# EAGLE design icewerx Carrier (EAGLE 9.6.2)
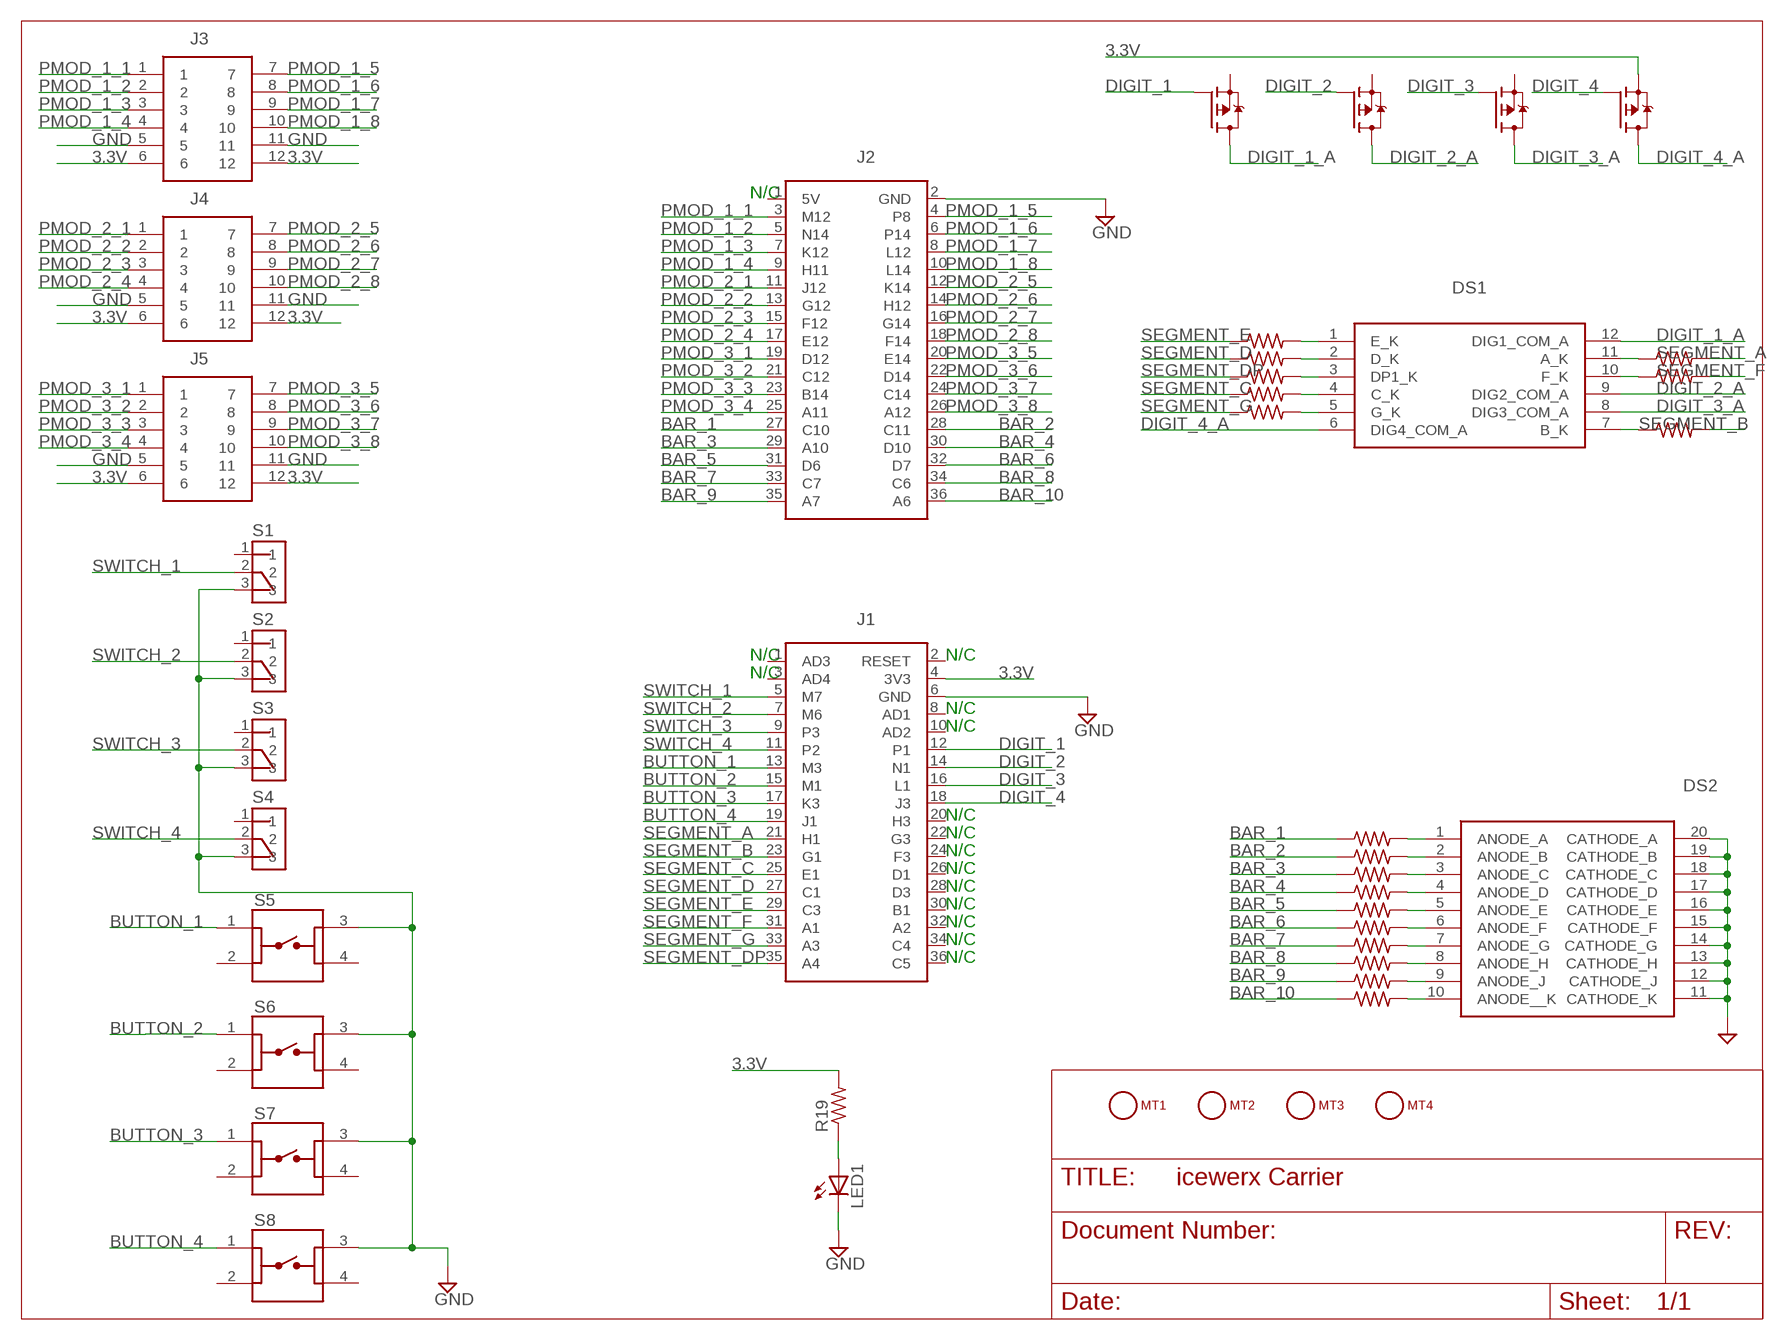
[diagram p0: schematic, sheet 1]

## Parts
DS1  LDQ-M282RI  [LDQM282RI]
DS2  LTA-1000G  [DIPS762W50P254L2527H825Q20N]
J1  ICEWERX-PL2  [TE_4-1734506-1]
J2  ICEWERX-PL3  [TE_4-1734506-1]
J3  PMOD-SOCKET-FOR-HOST-BOARD  [PMOD-SOCKET-FOR-HOST-BOARD]
J4  PMOD-SOCKET-FOR-HOST-BOARD  [PMOD-SOCKET-FOR-HOST-BOARD]
J5  PMOD-SOCKET-FOR-HOST-BOARD  [PMOD-SOCKET-FOR-HOST-BOARD]
LED1  LED5MM  [LED5MM]
MT1  MOUNTING_HOLE-125_250_ROUND  [MT_125_250]
MT2  MOUNTING_HOLE-125_250_ROUND  [MT_125_250]
MT3  MOUNTING_HOLE-125_250_ROUND  [MT_125_250]
MT4  MOUNTING_HOLE-125_250_ROUND  [MT_125_250]
Q1  NX2301P  [SOT95P230X110-3N]
Q2  NX2301P  [SOT95P230X110-3N]
Q3  NX2301P  [SOT95P230X110-3N]
Q4  NX2301P  [SOT95P230X110-3N]
R1  R-US_0204/5  [0204/5]
R2  R-US_0204/5  [0204/5]
R3  R-US_0204/5  [0204/5]
R4  R-US_0204/5  [0204/5]
R5  R-US_0204/5  [0204/5]
R6  R-US_0204/5  [0204/5]
R7  R-US_0204/5  [0204/5]
R8  R-US_0204/5  [0204/5]
R9  R-US_0204/5  [0204/5]
R10  R-US_0204/5  [0204/5]
R11  R-US_0204/5  [0204/5]
R12  R-US_0204/5  [0204/5]
R13  R-US_0204/5  [0204/5]
R14  R-US_0204/5  [0204/5]
R15  R-US_0204/5  [0204/5]
R16  R-US_0204/5  [0204/5]
R17  R-US_0204/5  [0204/5]
R18  R-US_0204/5  [0204/5]
R19  R-US_0204/5  [0204/5]
S1  OS102011MS2QN1  [SW_OS102011MS2QN1]
S2  OS102011MS2QN1  [SW_OS102011MS2QN1]
S3  OS102011MS2QN1  [SW_OS102011MS2QN1]
S4  OS102011MS2QN1  [SW_OS102011MS2QN1]
S5  1825910-7  [SW_1825910-7]
S6  1825910-7  [SW_1825910-7]
S7  1825910-7  [SW_1825910-7]
S8  1825910-7  [SW_1825910-7]

## Nets
3.3V: J1.4(3V3) J3.6 J3.12 J4.6 J4.12 J5.6 J5.12 Q4.2(S) R19.2
BAR_1: J2.27(C10) R1.1
BAR_2: J2.28(C11) R2.1
BAR_3: J2.29(A10) R3.1
BAR_4: J2.30(D10) R5.1
BAR_5: J2.31(D6) R4.1
BAR_6: J2.32(D7) R6.1
BAR_7: J2.33(C7) R7.1
BAR_8: J2.34(C6) R8.1
BAR_9: J2.35(A7) R10.1
BAR_10: J2.36(A6) R9.1
BUTTON_1: J1.13(M3) S5.1
BUTTON_2: J1.15(M1) S6.1
BUTTON_3: J1.17(K3) S7.1
BUTTON_4: J1.19(J1) S8.1
DIGIT_1: J1.12(P1) Q1.1(G)
DIGIT_1_A: DS1.12(DIG1_COM_A) Q1.3(D)
DIGIT_2: J1.14(N1) Q2.1(G)
DIGIT_2_A: DS1.9(DIG2_COM_A) Q2.3(D)
DIGIT_3: J1.16(L1) Q3.1(G)
DIGIT_3_A: DS1.8(DIG3_COM_A) Q3.3(D)
DIGIT_4: J1.18(J3) Q4.1(G)
DIGIT_4_A: DS1.6(DIG4_COM_A) Q4.3(D)
GND: DS2.11(CATHODE_K) DS2.12(CATHODE_J) DS2.13(CATHODE_H) DS2.14(CATHODE_G) DS2.15(CATHODE_F) DS2.16(CATHODE_E) DS2.17(CATHODE_D) DS2.18(CATHODE_C) DS2.19(CATHODE_B) DS2.20(CATHODE_A) J1.6(GND) J2.2(GND) J3.5 J3.11 J4.5 J4.11 J5.5 J5.11 LED1.K(C) S1.3 S2.3 S3.3 S4.3 S5.3 S6.3 S7.3 S8.3
N$1: DS1.1(E_K) R11.2
N$2: DS1.2(D_K) R12.2
N$3: DS1.3(DP1_K) R13.2
N$4: DS1.4(C_K) R14.2
N$5: DS1.5(G_K) R15.2
N$6: DS1.11(A_K) R16.1
N$8: DS1.7(B_K) R18.1
N$9: DS2.1(ANODE_A) R1.2
N$10: DS2.2(ANODE_B) R2.2
N$11: DS2.3(ANODE_C) R3.2
N$12: DS2.5(ANODE_E) R4.2
N$13: DS2.4(ANODE_D) R5.2
N$14: DS2.6(ANODE_F) R6.2
N$15: DS2.8(ANODE_H) R8.2
N$16: DS2.10(ANODE__K) R9.2
N$17: DS2.9(ANODE_J) R10.2
N$18: DS2.7(ANODE_G) R7.2
N$19: LED1.A R19.1
N$140: DS1.10(F_K) R17.1
PMOD_1_1: J2.3(M12) J3.1
PMOD_1_2: J2.5(N14) J3.2
PMOD_1_3: J2.7(K12) J3.3
PMOD_1_4: J2.9(H11) J3.4
PMOD_1_5: J2.4(P8) J3.7
PMOD_1_6: J2.6(P14) J3.8
PMOD_1_7: J2.8(L12) J3.9
PMOD_1_8: J2.10(L14) J3.10
PMOD_2_1: J2.11(J12) J4.1
PMOD_2_2: J2.13(G12) J4.2
PMOD_2_3: J2.15(F12) J4.3
PMOD_2_4: J2.17(E12) J4.4
PMOD_2_5: J2.12(K14) J4.7
PMOD_2_6: J2.14(H12) J4.8
PMOD_2_7: J2.16(G14) J4.9
PMOD_2_8: J2.18(F14) J4.10
PMOD_3_1: J2.19(D12) J5.1
PMOD_3_2: J2.21(C12) J5.2
PMOD_3_3: J2.23(B14) J5.3
PMOD_3_4: J2.25(A11) J5.4
PMOD_3_5: J2.20(E14) J5.7
PMOD_3_6: J2.22(D14) J5.8
PMOD_3_7: J2.24(C14) J5.9
PMOD_3_8: J2.26(A12) J5.10
SEGMENT_A: J1.21(H1) R16.2
SEGMENT_B: J1.23(G1) R18.2
SEGMENT_C: J1.25(E1) R14.1
SEGMENT_D: J1.27(C1) R12.1
SEGMENT_DP: J1.35(A4) R13.1
SEGMENT_E: J1.29(C3) R11.1
SEGMENT_F: J1.31(A1) R17.2
SEGMENT_G: J1.33(A3) R15.1
SWITCH_1: J1.5(M7) S1.2
SWITCH_2: J1.7(M6) S2.2
SWITCH_3: J1.9(P3) S3.2
SWITCH_4: J1.11(P2) S4.2
Unconnected: J1.1(AD3) J1.2(RESET) J1.3(AD4) J1.8(AD1) J1.10(AD2) J1.20(H3) J1.22(G3) J1.24(F3) J1.26(D1) J1.28(D3) J1.30(B1) J1.32(A2) J1.34(C4) J1.36(C5) J2.1(5V) MT1.1 MT2.1 MT3.1 MT4.1 Q1.2(S) Q2.2(S) Q3.2(S) S1.1 S2.1 S3.1 S4.1 S5.2 S5.4 S6.2 S6.4 S7.2 S7.4 S8.2 S8.4

## Notes on the sheet
- N/C
- N/C | N/C
- N/C
- N/C
- N/C
- N/C
- N/C
- N/C
- N/C
- N/C
- N/C
- N/C
- N/C
- N/C

## Library data of the parts
DS1 = eagle-library-engr-240-f22:LDQ-M282RI: LED Displays & Accessories LED Display Source: Datasheet <https://componentsearchengine.com/Datasheets/1/LDQ-M282RI.pdf>; DESCRIPTION: LED Displays & Accessories LED Display; HEIGHT: 6.05mm; MANUFACTURER_NAME: Lumex; MANUFACTURER_PART_NUMBER: LDQ-M282RI; MOUSER_PART_NUMBER: 696-LDQ-M282RI; MOUSER_PRICE-STOCK: https://www.mouser.com/Search/Refine.aspx?Keyword=696-LDQ-M282RI
DS2 = eagle-library-engr-240-f22:LTA-1000G: LED Uni-Color Green 565nm 20-Pin PDIP Source: Datasheet <https://optoelectronics.liteon.com/upload/download/DS-30-92-0809/A1000G.pdf>; DESCRIPTION: LED Uni-Color Green 565nm 20-Pin PDIP; HEIGHT: 8.25mm; MANUFACTURER_NAME: Lite-On; MANUFACTURER_PART_NUMBER: LTA-1000G; MOUSER_PART_NUMBER: 859-LTA-1000G; MOUSER_PRICE-STOCK: https://www.mouser.co.uk/ProductDetail/Lite-On/LTA-1000G?qs=%2FTKcI5XXRKq0QINzVmwJHg%3D%3D
J1 = eagle-library-engr-240-f22:ICEWERX-PL2
J2 = eagle-library-engr-240-f22:ICEWERX-PL3
J3-J5 = eagle-library-engr-240-f22:PMOD-SOCKET-FOR-HOST-BOARD
LED1 = eagle-library-engr-240-f22:LED: LED OSRAM: - CHIPLED LG R971, LG N971, LY N971, LG Q971, LY Q971, LO R971, LY R971 LH N974, LH R974 LS Q976, LO Q976, LY Q976 LO Q996 - Hyper CHIPLED LW Q18S LB Q993, LB Q99A, LB R99A - SideLED LS A670, LO A670, LY A670, LG A670, LP A670 LB A673, LV A673, LT A673, LW A673 LH A674 LY A675 LS A676, LA A676, LO A676, LY A676, LW A676 LS A679, LY A679, LG A679 - Hyper Micro SIDELED® LS Y876, LA Y876, LO Y876, LY Y876 LT Y87S - SmartLED LW L88C, LW L88S LB L89C, LB L89S, LG L890 LS L89K, LO L89K, LY L89K LS L896, LA L896, LO L896, LY L896 - TOPLED LS T670, LO T670, LY T670, LG T670, LP T670 LSG T670, LSP T670, LSY T670, LOP T670, LYG T670 LG T671, LOG T671, LSG T671 LB T673, LV T673, LT T673, LW T673 LH T674 LS T676, LA T676, LO T676, LY T676, LB T676, LH T676, LSB T676, LW T676 LB T67C, LV T67C, LT T67C, LS T67K, LO T67K, LY T67K, LW E67C LS E67B, LA E67B, LO E67B, LY E67B, LB E67C, LV E67C, LT E67C LW T67C LS T679, LY T679, LG T679 LS T770, LO T770, LY T770, LG T770, LP T770 LB T773, LV T773, LT T773, LW T773 LH T774 LS E675, LA E675, LY E675, LS T675 LS T776, LA T776, LO T776, LY T776, LB T776 LHGB T686 LT T68C, LB T68C - Hyper Mini TOPLED® LB M676 - Mini TOPLED Santana® LG M470 LS M47K, LO M47K, LY M47K Source: http://www.osram.convergy.de/
MT1-MT4 = eagle-library-engr-240-f22:MOUNTING_HOLE
Q1-Q4 = eagle-library-engr-240-f22:NX2301P; MANUFACTURER: Nexperia; MAXIMUM_PACKAGE_HEIGHT: 1.10 mm; PARTREV: 1; SNAPEDA_PN: NX2301P; STANDARD: IPC 7351B
R1-R19 = eagle-library-engr-240-f22:R-US_: RESISTOR, American symbol
S1-S4 = eagle-library-engr-240-f22:OS102011MS2QN1: Switch Slide ON ON SPDT Top Slide 0.1A 12VDC 10000Cycles PC Pins Thru-Hole Bulk; MANUFACTURER: C&K; STANDARD: MANUFACTURER RECOMMENDATIONS
S5-S8 = eagle-library-engr-240-f22:1825910-7: Switch Tactile OFF (ON) SPST Round Button PC Pins 0.05A 24VDC 100000Cycles 2.55N Thru-Hole Loose; MANUFACTURER: TE Connectivity; PARTREV: C10; STANDARD: Manufacturer Recommendation

## Board
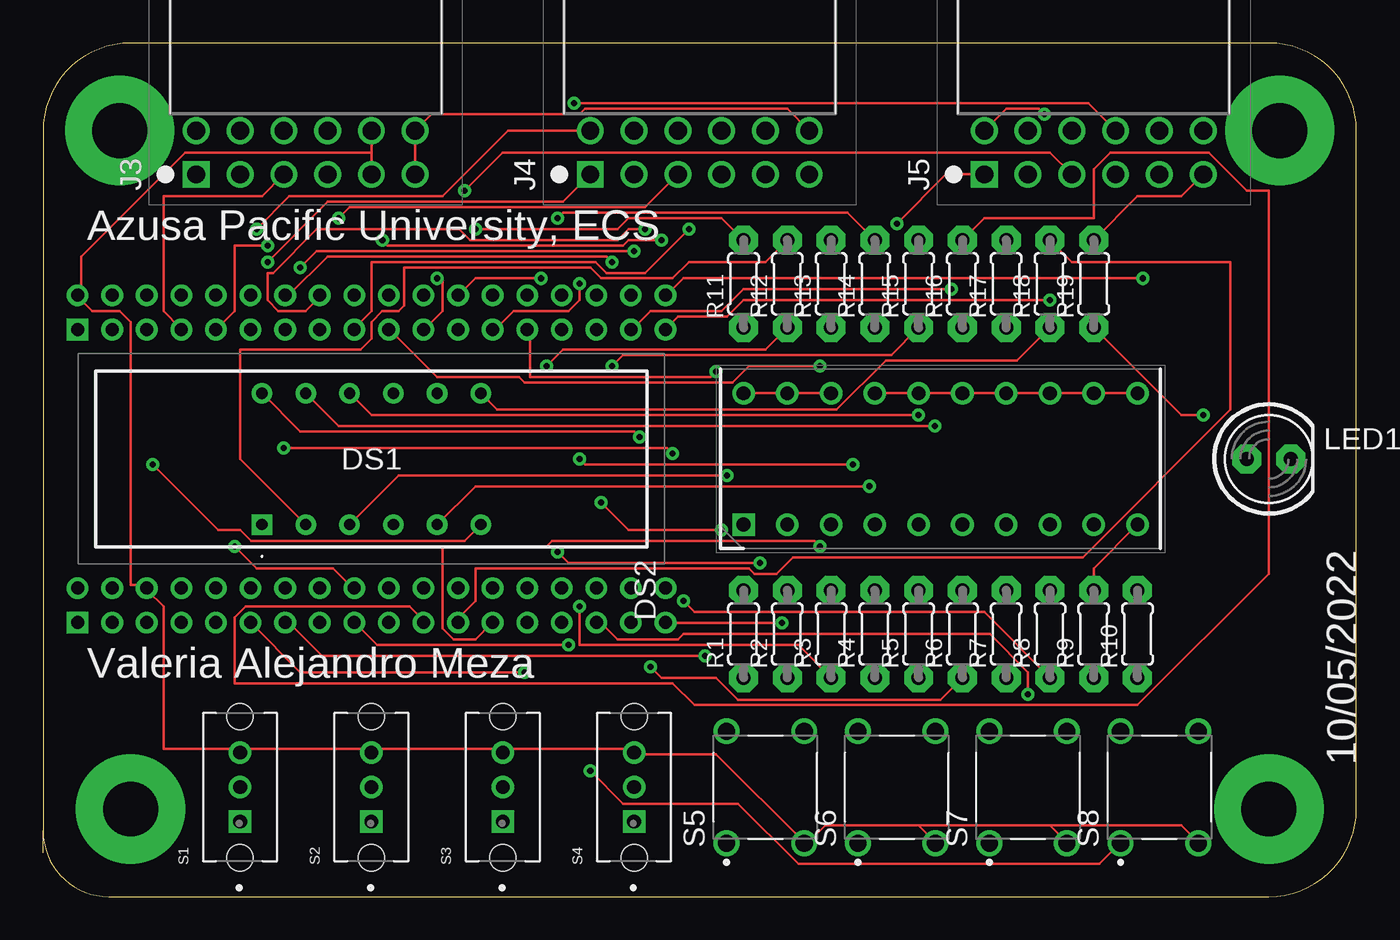
[diagram p1: board, top side]
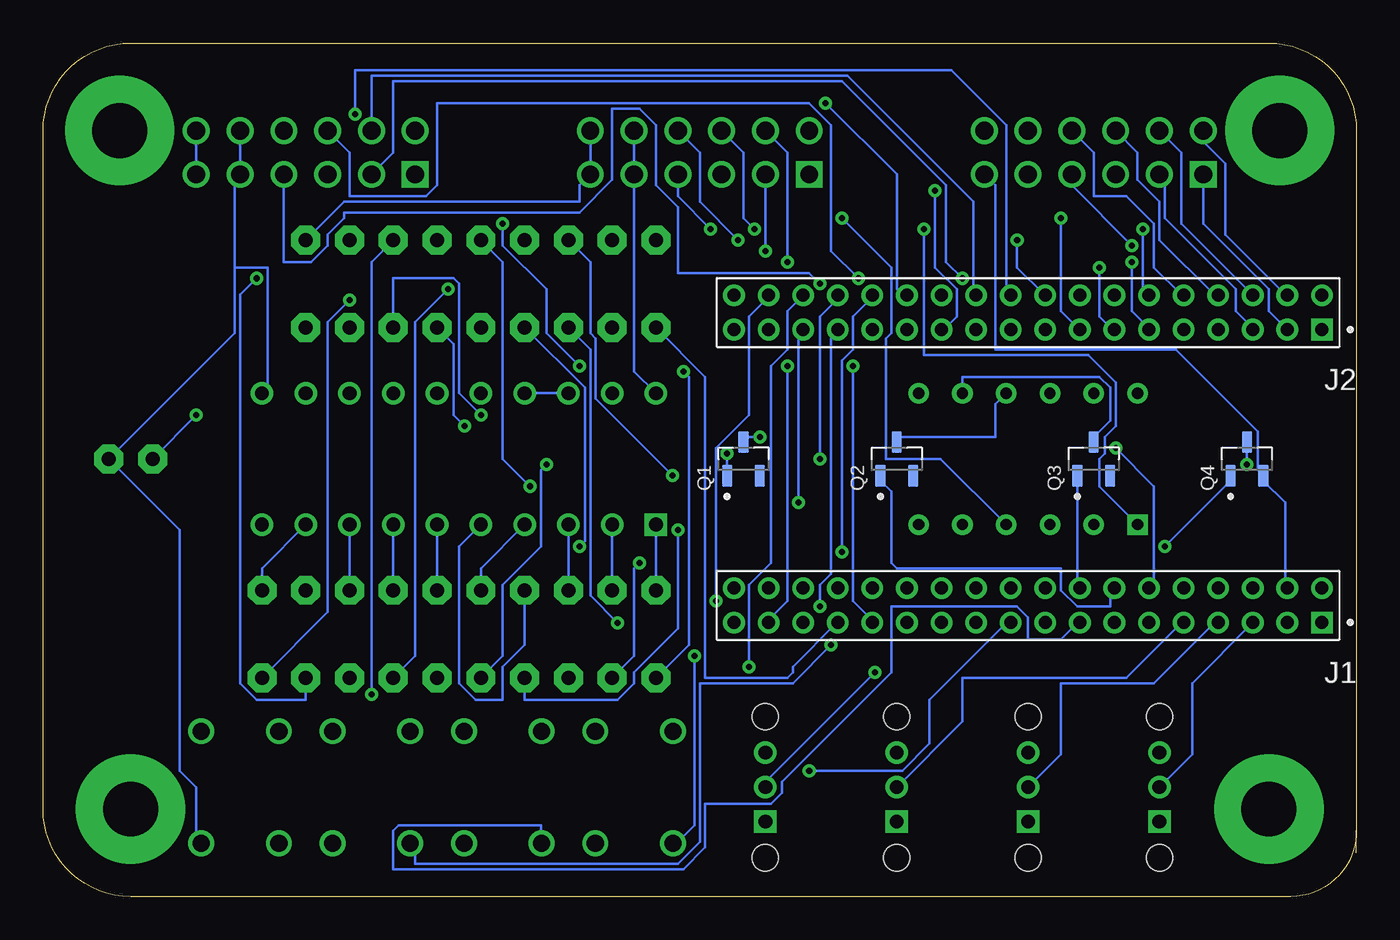
[diagram p2: board, bottom side, seen from below]

Size 76.2 x 49.53 mm. Coordinates in mm from the lower left corner, seen from the top.
Outline: 0,2.54 0,3.81
Outline: 0,3.81 arc90 3.81,0 71.12,0 arc90 76.2,5.08 76.2,44.45 arc90 71.12,49.53 5.08,49.53 arc90 0,44.45 0,3.81
Copper layers (1*16): Top 0.035mm / dielectric 1.5mm / Bottom 0.035mm
Design rules "default *": minimum track width 6mil, minimum drill 0.35mm, track to track 6mil, track to pad 6mil, pad to pad 6mil, via to via 6mil, smd to smd 6mil, copper to edge 40mil, drill to drill 6mil, minimum pad ring 10mil, minimum via ring 8mil, stop-mask expansion 2.5mil, vias tented up to drill 15mil, thermal gap 10mil

### Footprints (pad centres in the part's own frame; a part is rotated, then mirrored left to right if it is on the bottom)
LDQM282RI = drill 0.65 pad 1.192 square: 1 0,0 | drill 0.65 pad 1.192: 2 2.54,0; 3 5.08,0; 4 7.62,0; 5 10.16,0; 6 12.7,0; 7 12.7,7.62; 8 10.16,7.62; 9 7.62,7.62; 10 5.08,7.62; 11 2.54,7.62; 12 0,7.62
DIPS762W50P254L2527H825Q20N = drill 0.8 pad 1.2 square: 1 0,0 | drill 0.8 pad 1.2: 2 0,-2.54; 3 0,-5.08; 4 0,-7.62; 5 0,-10.16; 6 0,-12.7; 7 0,-15.24; 8 0,-17.78; 9 0,-20.32; 10 0,-22.86; 11 7.62,-22.86; 12 7.62,-20.32; 13 7.62,-17.78; 14 7.62,-15.24; 15 7.62,-12.7; 16 7.62,-10.16; 17 7.62,-7.62; 18 7.62,-5.08; 19 7.62,-2.54; 20 7.62,0
TE_4-1734506-1 = drill 0.75 pad 1.1 square: 1 0,0 | drill 0.75 pad 1.1: 2 0,-2; 3 2.007,0; 4 2.007,-2; 5 4.013,0; 6 4.013,-2; 7 6.02,0; 8 6.02,-2; 9 8.026,0; 10 8.026,-2; 11 10.033,0; 12 10.033,-2; 13 12.04,0; 14 12.04,-2; 15 14.046,0; 16 14.046,-2; 17 16.053,0; 18 16.053,-2; 19 18.059,0; 20 18.059,-2; 21 20.066,0; 22 20.066,-2; 23 22.073,0; 24 22.073,-2; 25 24.079,0; 26 24.079,-2; 27 26.086,0; 28 26.086,-2; 29 28.092,0; 30 28.092,-2; 31 30.099,0; 32 30.099,-2; 33 32.106,0; 34 32.106,-2; 35 34.112,0; 36 34.112,-2
PMOD-SOCKET-FOR-HOST-BOARD = drill 1.04 pad 1.55 square: 1 0,0 | drill 1.04 pad 1.55: 2 2.54,0; 3 5.08,0; 4 7.62,0; 5 10.16,0; 6 12.7,0; 7 0,2.54; 8 2.54,2.54; 9 5.08,2.54; 10 7.62,2.54; 11 10.16,2.54; 12 12.7,2.54
LED5MM = drill 0.813 pad 1.676 octagon: A -1.27,0; K 1.27,0
MT_125_250 = drill 3.175 pad 6.35: 1 0,0
SOT95P230X110-3N = smd 1.26 x 0.59: 1 -0.98,0.95; 2 -0.98,-0.95; 3 0.98,0
0204/5 = drill 0.813 pad 1.676 octagon: 1 -2.54,0; 2 2.54,0
SW_OS102011MS2QN1 = drill 0.8 square: 1 -2,0 | drill 0.8: 2 0,0; 3 2,0 | hole 1.5: -4.1,0; 4.1,0
SW_1825910-7 = drill 0.99: 1 -3.25,2.25; 2 3.25,2.25; 3 -3.25,-2.25; 4 3.25,-2.25

### Placement (x,y rotation side)
DS1  12.7,21.59 0 top
DS2  40.64,21.59 90 top
J1  2,15.9 180 bottom
J2  2,32.9 180 bottom
J3  8.89,41.91 0 top
J4  31.75,41.91 0 top
J5  54.61,41.91 0 top
LED1  71.12,25.4 0 top
MT1  4.45,44.45 0 top
MT2  71.75,44.45 0 top
MT3  5.08,5.08 0 top
MT4  71.12,5.08 0 top
Q1  35.56,25.4 90 bottom
Q2  26.67,25.4 90 bottom
Q3  15.24,25.4 90 bottom
Q4  6.35,25.4 90 bottom
R1  40.64,15.24 90 top
R2  43.18,15.24 90 top
R3  45.72,15.24 90 top
R4  48.26,15.24 90 top
R5  50.8,15.24 90 top
R6  53.34,15.24 90 top
R7  55.88,15.24 90 top
R8  58.42,15.24 90 top
R9  60.96,15.24 90 top
R10  63.5,15.24 90 top
R11  40.64,35.56 90 top
R12  43.18,35.56 90 top
R13  45.72,35.56 90 top
R14  48.26,35.56 90 top
R15  50.8,35.56 90 top
R16  53.34,35.56 90 top
R17  55.88,35.56 90 top
R18  58.42,35.56 90 top
R19  60.96,35.56 90 top
S1  11.43,6.35 90 top
S2  19.05,6.35 90 top
S3  26.67,6.35 90 top
S4  34.29,6.35 90 top
S5  41.91,6.35 90 top
S6  49.53,6.35 90 top
S7  57.15,6.35 90 top
S8  64.77,6.35 90 top

### Tracks (layer width: path | path; a pad name or v marks a point on that pad's centre or on a via)
3.3V
  Top 0.152: R19.2 63.5,40.64 66.04,40.64 J5.6 | J3.6 J3.12 22.54,45.4 31.11,45.4 31.43,45.72 43.18,45.72 J4.12
  Bottom 0.152: J5.12 J5.6 | J1.4 4.13,18.1 4.13,22.86 5.4,24.13 Q4.2 5.4,24.45 5.71,24.77 5.71,26.99 10.48,31.75 20.95,31.75 20.95,41.27 J3.6 | J4.12 J4.6 45.09,41.27 45.09,40.32 58.74,40.32 R19.2
BAR_1  (via drill 0.35)
  Top 0.152: v39.05,30.48 38.73,30.16 28.26,30.16 28.26,32.7 J2.27
  Bottom 0.152: v39.05,30.48 38.73,30.16 38.73,14.61 R1.1
BAR_2  (via drill 0.35)
  Top 0.152: v29.84,20 30.48,19.37 v41.59,19.37
  Bottom 0.152: v29.84,20 29.84,31.11 29.21,31.75 29.21,33.66 28.26,34.61 J2.28 | v41.59,19.37 41.91,19.05 41.91,13.97 R2.1
BAR_3  (via drill 0.35)
  Top 0.152: v31.11,16.83 31.11,14.61 43.81,14.61 R3.1
  Bottom 0.152: v31.11,16.83 31.11,18.1 30.48,18.73 30.48,32.38 30.16,32.7 J2.29
BAR_4  (via drill 0.35)
  Top 0.152: v31.11,25.4 31.43,25.08 v46.99,25.08
  Bottom 0.152: v31.11,25.4 31.11,33.66 30.16,34.61 J2.30 | v46.99,25.08 47.31,24.77 47.31,20.32 49.53,18.1 49.53,13.97 R5.1
BAR_5  (via drill 0.35)
  Top 0.152: v32.38,22.86 33.97,21.27 v39.37,21.27
  Bottom 0.152: v32.38,22.86 32.38,32.7 J2.31 | v39.37,21.27 39.37,15.56 41.91,13.02 41.91,12.38 42.86,11.43 48.26,11.43 R4.1
BAR_6  (via drill 0.35)
  Top 0.152: v35.24,13.34 35.88,12.7 39.05,12.7 40.32,11.43 52.07,11.43 R6.1
  Bottom 0.152: v35.24,13.34 35.24,18.1 33.97,19.37 33.97,30.8 33.02,31.75 33.02,33.97 32.38,34.61 J2.32
BAR_7  (via drill 0.35)
  Top 0.152: v52.7,35.24 40.64,35.24 39.37,33.97 35.24,33.97 34.29,33.02 J2.33
  Bottom 0.152: v52.7,35.24 54.61,33.34 54.61,13.97 R7.1
BAR_8  (via drill 0.35)
  Top 0.152: v37.15,17.14 37.78,16.51 54.61,16.51 R8.1
  Bottom 0.152: v37.15,17.14 37.15,26.04 35.24,27.94 35.24,33.66 34.29,34.61 J2.34
BAR_9  (via drill 0.35)
  Top 0.152: v58.42,34.61 40.64,34.61 39.69,33.66 36.83,33.66 36.2,33.02 J2.35
  Bottom 0.152: v58.42,34.61 59.69,33.34 59.69,16.51 R10.1
BAR_10  (via drill 0.35)
  Top 0.152: v63.82,35.88 37.15,35.88 36.2,34.92 J2.36
  Bottom 0.152: v63.82,35.88 64.77,34.92 64.77,12.38 63.82,11.43 60.96,11.43 R9.1
BUTTON_1  (via drill 0.35)
  Top 0.152: v38.42,13.97 16.19,13.97 14.29,15.88 J1.13
  Bottom 0.152: v38.42,13.97 38.42,4.13 39.37,3.17 S5.1
BUTTON_2
  Bottom 0.152: J1.15 16.19,15.88 17.14,14.92 19.05,14.92 19.05,16.19 19.68,16.83 26.99,16.83 26.99,13.02 33.34,6.67 33.34,6.03 33.97,5.4 37.78,5.4 37.78,2.86 39.05,1.59 55.88,1.59 55.88,3.81 55.56,4.13 47.31,4.13 47.31,3.17 S6.1
BUTTON_3  (via drill 0.35)
  Top 0.152: v30.48,14.61 19.37,14.61 18.1,15.88 J1.17
  Bottom 0.152: v30.48,14.61 32.7,12.38 38.1,12.38 38.1,3.17 39.37,1.91 54.61,1.91 54.61,2.86 S7.1
BUTTON_4  (via drill 0.35)
  Top 0.152: v31.75,7.3 33.66,5.4 40.32,5.4 43.81,1.91 61.28,1.91 62.23,2.86 S8.1
  Bottom 0.152: v31.75,7.3 26.35,7.3 24.77,8.89 24.77,11.43 20.32,15.88 J1.19
DIGIT_1  (via drill 0.35)
  Top 0.152: v36.51,25.72 36.2,26.04 v13.97,26.04
  Bottom 0.152: v36.51,25.72 36.51,24.45 Q1.1 | v13.97,26.04 11.75,23.81 11.75,18.1 J1.12
DIGIT_1_A  (via drill 0.35)
  Top 0.152: v34.61,26.67 34.29,26.99 14.92,26.99 DS1.12
  Bottom 0.152: v34.61,26.67 35.56,26.67 Q1.3
DIGIT_2
  Bottom 0.152: Q2.1 27.62,24.13 26.99,23.5 26.99,19.37 26.67,19.05 17.14,19.05 17.14,17.78 16.19,16.83 14.29,16.83 14.29,17.78 J1.14
DIGIT_2_A
  Bottom 0.152: DS1.9 20.95,28.57 20.95,26.67 26.67,26.67 Q2.3
DIGIT_3
  Bottom 0.152: Q3.1 16.19,24.13 16.19,18.1 J1.16
DIGIT_3_A
  Bottom 0.152: DS1.8 22.86,30.16 14.92,30.16 14.29,29.53 14.29,27.62 15.24,26.67 Q3.3
DIGIT_4  (via drill 0.35)
  Top 0.152: v11.11,20.32 12.38,19.05 16.83,19.05 17.78,18.1 J1.18
  Bottom 0.152: v11.11,20.32 7.3,24.13 Q4.1
DIGIT_4_A  (via drill 0.35)
  Top 0.152: v6.35,25.08 10.16,21.27 11.43,21.27 12.06,20.64 24.45,20.64 DS1.6
  Bottom 0.152: v6.35,25.08 Q4.3
GND
  Top 0.152: DS2.17 DS2.16 DS2.15 DS2.14 DS2.13 DS2.12 DS2.11 | DS2.20 DS2.19 DS2.18 | 50.8,4.13 45.4,4.13 44.45,3.17 S5.3 44.13,3.17 39.05,8.26 34.29,8.26 S4.3 34.29,8.57 26.67,8.57 | 50.8,4.13 51.75,3.17 S6.3 | 58.42,4.13 59.37,3.17 S7.3 | 50.8,4.13 58.42,4.13 | 58.42,4.13 66.04,4.13 66.99,3.17 S8.3 | J3.11 19.05,43.18 | 19.05,43.18 J3.5 | 11.43,8.57 6.99,8.57 6.99,16.83 6.03,17.78 J1.6 5.71,18.1 5.08,18.1 5.08,33.34 4.45,33.97 2.86,33.97 2.22,34.61 J2.2 2.22,34.92 2.22,37.15 8.26,43.18 19.05,43.18 | 11.43,8.57 19.05,8.57 | 11.43,8.57 S1.3 | 19.05,8.57 26.67,8.57 | 19.05,8.57 S2.3 | 26.67,8.57 S3.3
  Bottom 0.152: J5.11 J5.5 65.09,41.59 65.09,36.51 | 65.09,36.51 65.09,32.7 LED1.K 68.26,21.27 68.26,7.3 67.31,6.35 67.31,3.17 S8.3 | J4.11 J4.5 41.91,30.48 DS2.20 | DS2.18 DS2.17 | 65.09,36.51 63.18,36.51 63.18,29.53 DS2.11
N$1  (via drill 0.35)
  Top 0.152: v25.08,38.73 33.34,38.73 33.97,39.37 39.37,39.37 R11.2
  Bottom 0.152: DS1.1 14.92,23.81 14.92,25.4 14.61,25.72 14.61,26.67 13.97,27.3 13.97,29.84 15.56,31.43 25.08,31.43 v25.08,38.73
N$2
  Top 0.152: DS1.2 11.43,25.4 11.43,31.75 18.41,31.75 19.05,32.38 19.05,33.34 19.68,33.97 20.64,33.97 20.95,34.29 20.95,36.51 31.75,36.51 32.38,35.88 36.51,35.88 37.47,36.83 41.91,36.83 R12.2
N$3  (via drill 0.35)
  Top 0.152: DS1.3 20.64,24.45 v39.69,24.45
  Bottom 0.152: v39.69,24.45 44.13,28.89 44.13,32.38 44.45,32.7 44.45,36.83 R13.2
N$4  (via drill 0.35)
  Top 0.152: v29.84,39.37 30.16,39.69 46.67,39.69 R14.2
  Bottom 0.152: DS1.4 24.13,25.4 27.3,25.4 27.3,32.38 26.99,32.7 26.99,36.51 v29.84,39.37
N$5  (via drill 0.35)
  Top 0.152: DS1.5 25.08,23.81 v47.94,23.81
  Bottom 0.152: v47.94,23.81 49.53,25.4 49.53,36.83 R15.2
N$6  (via drill 0.35)
  Top 0.152: DS1.11 17.14,27.3 v51.75,27.3
  Bottom 0.152: v51.75,27.3 52.39,27.94 52.39,32.07 R16.1
N$8
  Top 0.152: DS1.7 26.35,28.26 46.04,28.26 48.9,31.11 56.52,31.11 R18.1
N$9
  Bottom 0.152: R1.2 DS2.1
N$10
  Bottom 0.152: R2.2 DS2.2
N$11
  Bottom 0.152: R3.2 DS2.3
N$12
  Bottom 0.152: DS2.5 52.07,20.32 52.07,12.38 51.12,11.43 49.53,11.43 49.53,13.34 48.26,14.61 R4.2
N$13
  Bottom 0.152: DS2.4 50.8,19.05 R5.2
N$14
  Bottom 0.152: R6.2 DS2.6
N$15
  Bottom 0.152: R8.2 DS2.8
N$16
  Top 0.152: DS2.10 60.96,19.05 R9.2
N$17
  Bottom 0.152: DS2.9 63.5,19.05 R10.2
N$18
  Bottom 0.152: R7.2 DS2.7
N$19  (via drill 0.35)
  Top 0.152: R19.1 66.04,27.94 v67.31,27.94
  Bottom 0.152: LED1.A v67.31,27.94
N$140  (via drill 0.35)
  Top 0.152: DS1.10 19.05,27.94 v50.8,27.94
  Bottom 0.152: v50.8,27.94 52.07,29.21 52.07,35.56 52.39,35.88 55.88,35.88 R17.1
PMOD_1_1
  Bottom 0.152: J3.1 8.89,39.05 5.08,35.24 5.08,33.97 4.13,33.02 J2.3
PMOD_1_2
  Bottom 0.152: J3.2 11.11,41.59 11.11,39.37 6.99,35.24 6.99,33.97 6.03,33.02 J2.5
PMOD_1_3
  Top 0.152: J3.3 12.7,40.64 6.99,40.64 6.99,33.97 7.94,33.02 J2.7
PMOD_1_4  (via drill 0.35)
  Top 0.152: v13.02,37.78 11.11,37.78 11.11,33.97 10.16,33.02 J2.9
  Bottom 0.152: v13.02,37.78 16.51,41.27 J3.4
PMOD_1_5
  Bottom 0.152: J3.7 8.89,43.81 7.62,42.55 7.62,38.42 4.13,34.92 J2.4
PMOD_1_6
  Bottom 0.152: J3.8 10.16,43.18 10.16,39.05 6.03,34.92 J2.6
PMOD_1_7
  Bottom 0.152: J3.9 12.7,43.18 12.7,41.59 11.43,40.32 11.43,38.1 8.26,34.92 J2.8
PMOD_1_8
  Bottom 0.152: J3.10 15.24,43.18 15.24,40.64 13.34,40.64 11.75,39.05 11.75,36.51 10.16,34.92 J2.10
PMOD_2_1  (via drill 0.35)
  Top 0.152: v13.02,36.83 16.51,40.32 30.16,40.32 J4.1
  Bottom 0.152: v13.02,36.83 13.02,33.97 12.06,33.02 J2.11
PMOD_2_2  (via drill 0.35)
  Top 0.152: v14.92,36.51 15.88,37.47 v34.29,37.47
  Bottom 0.152: v14.92,36.51 14.92,33.66 14.29,33.02 J2.13 | J4.2 v34.29,37.47
PMOD_2_3  (via drill 0.35)
  Top 0.152: v17.14,39.37 17.78,40.01 34.92,40.01 J4.3
  Bottom 0.152: v17.14,39.37 17.14,33.97 16.19,33.02 J2.15
PMOD_2_4  (via drill 0.35)
  Top 0.152: v37.47,38.73 34.92,36.2 32.7,36.2 32.07,36.83 19.05,36.83 19.05,33.97 18.1,33.02 J2.17
  Bottom 0.152: v37.47,38.73 39.37,40.64 J4.4
PMOD_2_5  (via drill 0.35)
  Top 0.152: v12.38,38.73 14.29,40.64 23.18,40.64 26.99,44.45 J4.7
  Bottom 0.152: v12.38,38.73 12.38,35.24 12.06,34.92 J2.12
PMOD_2_6  (via drill 0.35)
  Top 0.152: v33.02,36.83 32.7,37.15 16.51,37.15 14.29,34.92 J2.14
  Bottom 0.152: v33.02,36.83 33.02,43.18 J4.8
PMOD_2_7  (via drill 0.35)
  Top 0.152: v34.92,38.73 33.97,38.73 33.34,38.1 24.77,38.1 24.13,38.73 15.88,38.73 13.34,36.2 13.02,36.2 13.02,34.61 13.65,33.97 15.24,33.97 15.88,34.61 J2.16
  Bottom 0.152: v34.92,38.73 35.56,39.37 35.56,43.18 J4.9
PMOD_2_8  (via drill 0.35)
  Top 0.152: v19.68,38.1 20,37.78 33.66,37.78 33.97,38.1 v35.88,38.1
  Bottom 0.152: v19.68,38.1 19.68,36.51 18.1,34.92 J2.18 | v35.88,38.1 38.1,40.32 38.1,43.18 J4.10
PMOD_3_1  (via drill 0.35)
  Top 0.152: v45.09,30.8 40.96,30.8 40.01,29.84 27.94,29.84 27.62,30.16 22.86,30.16 20.32,32.7 J2.19 | v49.53,39.05 52.39,41.91 J5.1
  Bottom 0.152: v45.09,30.8 46.99,32.7 46.99,35.24 49.53,37.78 v49.53,39.05
PMOD_3_2  (via drill 0.35)
  Top 0.152: v22.86,35.88 23.18,35.88 23.18,33.97 22.23,33.02 J2.21
  Bottom 0.152: v22.86,35.88 23.81,36.83 23.81,41.27 29.84,47.31 55.88,47.31 55.88,43.18 J5.2
PMOD_3_3  (via drill 0.35)
  Top 0.152: v24.45,40.96 26.67,43.18 58.42,43.18 J5.3
  Bottom 0.152: v24.45,40.96 24.45,36.51 23.18,35.24 23.18,33.66 23.81,33.02 J2.23
PMOD_3_4  (via drill 0.35)
  Top 0.152: v31.11,35.56 31.11,34.61 30.48,33.97 27.3,33.97 26.35,33.02 J2.25
  Bottom 0.152: v31.11,35.56 31.75,36.2 39.37,36.2 39.37,40.01 40.64,41.27 40.64,44.77 41.59,45.72 43.18,45.72 43.18,41.59 45.09,39.69 58.74,39.69 58.74,39.37 59.69,38.42 59.69,37.78 60.64,36.83 62.23,36.83 J5.4
PMOD_3_5  (via drill 0.35)
  Top 0.152: v58.1,45.4 57.78,45.72 55.88,45.72 J5.7
  Bottom 0.152: v58.1,45.4 58.1,47.94 23.5,47.94 20.32,44.77 20.32,34.92 J2.20
PMOD_3_6
  Bottom 0.152: J5.8 57.15,47.62 29.53,47.62 22.23,40.32 22.23,34.92 J2.22
PMOD_3_7  (via drill 0.35)
  Top 0.152: v28.89,35.88 25.08,35.88 24.13,34.92 J2.24
  Bottom 0.152: v28.89,35.88 30.48,37.47 30.48,44.77 31.75,46.04 53.34,46.04 53.34,41.27 53.98,40.64 58.42,40.64 58.42,43.18 J5.9
PMOD_3_8  (via drill 0.35)
  Top 0.152: v30.8,46.04 60.64,46.04 J5.10
  Bottom 0.152: v30.8,46.04 26.67,41.91 26.67,35.24 26.35,34.92 J2.26
SEGMENT_A
  Top 0.152: R16.2 54.61,39.37 60.96,39.37 60.96,42.23 61.91,43.18 67.63,43.18 69.85,40.96 71.12,40.96 71.12,18.73 63.5,11.11 37.78,11.11 36.51,12.38 11.11,12.38 11.11,16.19 11.75,16.83 21.27,16.83 21.91,16.19 J1.21
SEGMENT_B
  Top 0.152: R18.2 59.69,36.83 68.9,36.83 68.9,28.26 60.33,19.68 43.5,19.68 42.55,18.73 41.27,18.73 40.96,19.05 25.08,19.05 25.08,17.14 24.13,16.19 J1.23
SEGMENT_C  (via drill 0.35)
  Top 0.152: v45.09,20.32 44.77,20.64 29.53,20.64 29.21,20.32 23.18,20.32 23.18,15.56 23.81,14.92 25.08,14.92 26.04,15.88 J1.25
  Bottom 0.152: v45.09,20.32 44.77,20.64 44.77,29.53 R14.1
SEGMENT_D  (via drill 0.35)
  Top 0.152: v29.21,30.8 30.16,31.75 41.91,31.75 R12.1
  Bottom 0.152: v29.21,30.8 29.21,17.14 28.26,16.19 J1.27
SEGMENT_DP  (via drill 0.35)
  Top 0.152: v42.86,15.88 36.2,15.88 J1.35
  Bottom 0.152: v42.86,15.88 44.45,17.46 44.45,31.75 R13.1
SEGMENT_E
  Bottom 0.152: R11.1 37.78,30.16 37.78,12.7 33.02,12.7 32.7,13.02 32.7,13.34 30.16,15.88 J1.29
SEGMENT_F  (via drill 0.35)
  Top 0.152: v57.15,11.75 57.15,13.02 54.93,15.24 37.15,15.24 36.83,14.92 33.34,14.92 32.38,15.88 J1.31
  Bottom 0.152: v57.15,11.75 57.15,36.83 R17.2
SEGMENT_G  (via drill 0.35)
  Top 0.152: v33.02,30.8 33.66,31.43 49.21,31.43 R15.1
  Bottom 0.152: v33.02,30.8 33.02,17.14 33.97,16.19 J1.33
SWITCH_1
  Bottom 0.152: S1.2 9.53,8.26 9.53,12.38 6.03,15.88 J1.5
SWITCH_2
  Bottom 0.152: S2.2 17.14,8.26 17.14,12.38 11.75,12.38 8.26,15.88 J1.7
SWITCH_3
  Bottom 0.152: S3.2 22.86,10.16 22.86,12.7 13.34,12.7 10.16,15.88 J1.9
SWITCH_4  (via drill 0.35)
  Top 0.152: v27.94,13.02 14.92,13.02 12.06,15.88 J1.11
  Bottom 0.152: v27.94,13.02 34.29,6.67 S4.2

### Text on the board
tPlace: Azusa Pacific University, ECS | Valeria Alejandro Meza | 10/05/2022